# EAGLE design mini-mite (EAGLE 6.2)
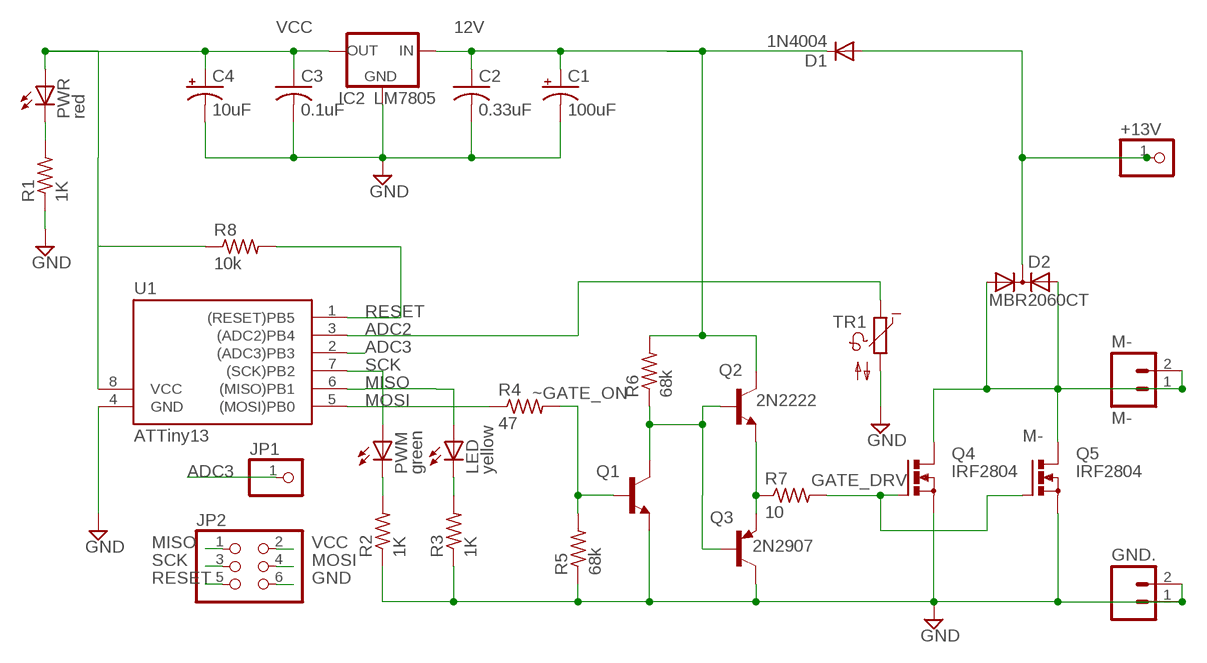
[diagram p0: schematic, sheet 1]

## Parts
+13V  PINHD-1X1  [1X01]
C1  100uF  CPOL-USE2.5-6  [E2,5-6]
C2  0.33uF  C-US025-025X050  [C025-025X050]
C3  0.1uF  C-US025-025X050  [C025-025X050]
C4  10uF  CPOL-USE2.5-6  [E2,5-6]
D1  1N4004  [DO41-10]
D2  MBR2060CT  DIODE-2AC|CATO220V  [TO220ABS]
GND.  M02LOCK_LONGPADS  [1X02_LOCK_LONGPADS]
IC2  LM7805  78XXS  [78XXS]
JP1  PINHD-1X1  [1X01]
JP2  PINHD-2X3  [2X03]
LED  yellow  LED5MM  [LED5MM]
M-  M-  M02LOCK_LONGPADS  [1X02_LOCK_LONGPADS]
PWM  green  LED5MM  [LED5MM]
PWR  red  LED5MM  [LED5MM]
Q1  2N2222  [TO92-EBC-OVAL]
Q2  2N2222  [TO92-EBC-OVAL]
Q3  2N2907  [TO92-EBC-OVAL]
Q4  IRF2804  PMOSFET_NTO220BV  [TO220BV]
Q5  IRF2804  PMOSFET_NTO220BV  [TO220BV]
R1  1K  R-US_0207/7  [0207/7]
R2  1K  R-US_0207/7  [0207/7]
R3  1K  R-US_0207/7  [0207/7]
R4  47  R-US_0207/10  [0207/10]
R5  68k  R-US_0207/7  [0207/7]
R6  68k  R-US_0207/7  [0207/7]
R7  10  R-US_0207/7  [0207/7]
R8  10k  R-US_0207/7  [0207/7]
TR1  NTC642-6  [P642]
U1  ATTiny13  TINY138P3  [DIL08]

## Nets
12V: C1.+ C2.1 D1.C IC2.IN Q2.C R6.2
+13V: +13V.1 D1.A D2.C
ADC2: TR1.1 U1.3((ADC2)PB4)
ADC3: JP1.1 U1.2((ADC3)PB3)
GATE_DRV: Q4.G Q5.G R7.2
GATEON: Q1.C Q2.B Q3.B R6.1
GND: C1.- C2.2 C3.2 C4.- GND..1 GND..2 IC2.GND JP2.6 Q1.E Q3.C Q4.S Q5.S R1.1 R2.1 R3.1 R5.1 TR1.2 U1.4(GND)
M-: D2.A1 D2.A2 M-.1 M-.2 Q4.D Q5.D
MISO: JP2.1 LED.A U1.6((MISO)PB1)
MOSI: JP2.4 R4.1 U1.5((MOSI)PB0)
N$1: LED.K(C) R3.2
N$4: Q2.E Q3.E R7.1
N$5: PWR.K(C) R1.2
N$19: PWM.K(C) R2.2
RESET: JP2.5 R8.2 U1.1((RESET)PB5)
SCK: JP2.3 PWM.A U1.7((SCK)PB2)
VCC: C3.1 C4.+ IC2.OUT JP2.2 PWR.A R8.1 U1.8(VCC)
~GATE_ON: Q1.B R4.2 R5.2

## Library data of the parts
+13V JP1 = pinhead:PINHD-1X1: PIN HEADER
C1 C4 = resistor:CPOL-US: POLARIZED CAPACITOR, American symbol
C2 C3 = rcl:C-US: CAPACITOR, American symbol
D1 = diode:1N4004: DIODE general purpose rectifier, 1 A
D2 = diode:DIODE-2AC|CA: Dual DIODE Anode-Cathode|Cathode-Anode
GND. M- = SparkFun:M02: Header 2 Standard 2-pin 0.1" header. Use with straight break away headers (SKU : PRT-00116), right angle break away headers (PRT-00553), swiss pins (PRT-00743), machine pins (PRT-00117), and female headers (PRT-00115). Molex polarized connector foot print use with SKU : PRT-08233 with associated crimp pins and housings.
IC2 = v-reg:78XXS: VOLTAGE REGULATOR
JP2 = pinhead:PINHD-2X3: PIN HEADER
LED PWM PWR = led:LED: LED OSRAM: - CHIPLED LG R971, LG N971, LY N971, LG Q971, LY Q971, LO R971, LY R971 LH N974, LH R974 LS Q976, LO Q976, LY Q976 LO Q996 - Hyper CHIPLED LW Q18S LB Q993, LB Q99A, LB R99A - SideLED LS A670, LO A670, LY A670, LG A670, LP A670 LB A673, LV A673, LT A673, LW A673 LH A674 LY A675 LS A676, LA A676, LO A676, LY A676, LW A676 LS A679, LY A679, LG A679 - Hyper Micro SIDELED® LS Y876, LA Y876, LO Y876, LY Y876 LT Y87S - SmartLED LW L88C, LW L88S LB L89C, LB L89S, LG L890 LS L89K, LO L89K, LY L89K LS L896, LA L896, LO L896, LY L896 - TOPLED LS T670, LO T670, LY T670, LG T670, LP T670 LSG T670, LSP T670, LSY T670, LOP T670, LYG T670 LG T671, LOG T671, LSG T671 LB T673, LV T673, LT T673, LW T673 LH T674 LS T676, LA T676, LO T676, LY T676, LB T676, LH T676, LSB T676, LW T676 LB T67C, LV T67C, LT T67C, LS T67K, LO T67K, LY T67K, LW E67C LS E67B, LA E67B, LO E67B, LY E67B, LB E67C, LV E67C, LT E67C LW T67C LS T679, LY T679, LG T679 LS T770, LO T770, LY T770, LG T770, LP T770 LB T773, LV T773, LT T773, LW T773 LH T774 LS E675, LA E675, LY E675, LS T675 LS T776, LA T776, LO T776, LY T776, LB T776 LHGB T686 LT T68C, LB T68C - Hyper Mini TOPLED® LB M676 - Mini TOPLED Santana® LG M470 LS M47K, LO M47K, LY M47K Source: http://www.osram.convergy.de LUXEON: - LUMILED® LXK2-PW12-R00, LXK2-PW12-S00, LXK2-PW14-U00, LXK2-PW14-V00 LXK2-PM12-R00, LXK2-PM12-S00, LXK2-PM14-U00 LXK2-PE12-Q00, LXK2-PE12-R00, LXK2-PE12-S00, LXK2-PE14-T00, LXK2-PE14-U00 LXK2-PB12-K00, LXK2-PB12-L00, LXK2-PB12-M00, LXK2-PB14-N00, LXK2-PB14-P00, LXK2-PB14-Q00 LXK2-PR12-L00, LXK2-PR12-M00, LXK2-PR14-Q00, LXK2-PR14-R00 LXK2-PD12-Q00, LXK2-PD12-R00, LXK2-PD12-S00 LXK2-PH12-R00, LXK2-PH12-S00 LXK2-PL12-P00, LXK2-PL12-Q00, LXK2-PL12-R00 Source: www.luxeon.com KINGBRIGHT: KA-3528ASYC Source: www.kingbright.com
Q1 Q2 = adafruit:2N2222: NPN TRANSISTOR Big oval pads
Q3 = adafruit:2N2907*: PNP Transistor Big Oval pads
Q4 Q5 = transistor-power:PMOSFET_N: Power MOSFET N-Channel
R1-R8 = resistor:R-US_: RESISTOR, American symbol
TR1 = ptc-ntc:NTC642-6: PHILIPS NTC
U1 = avr-4:TINY13*

## Net classes
1 power: width 1.27 mm, clearance 0.787 mm

## Board
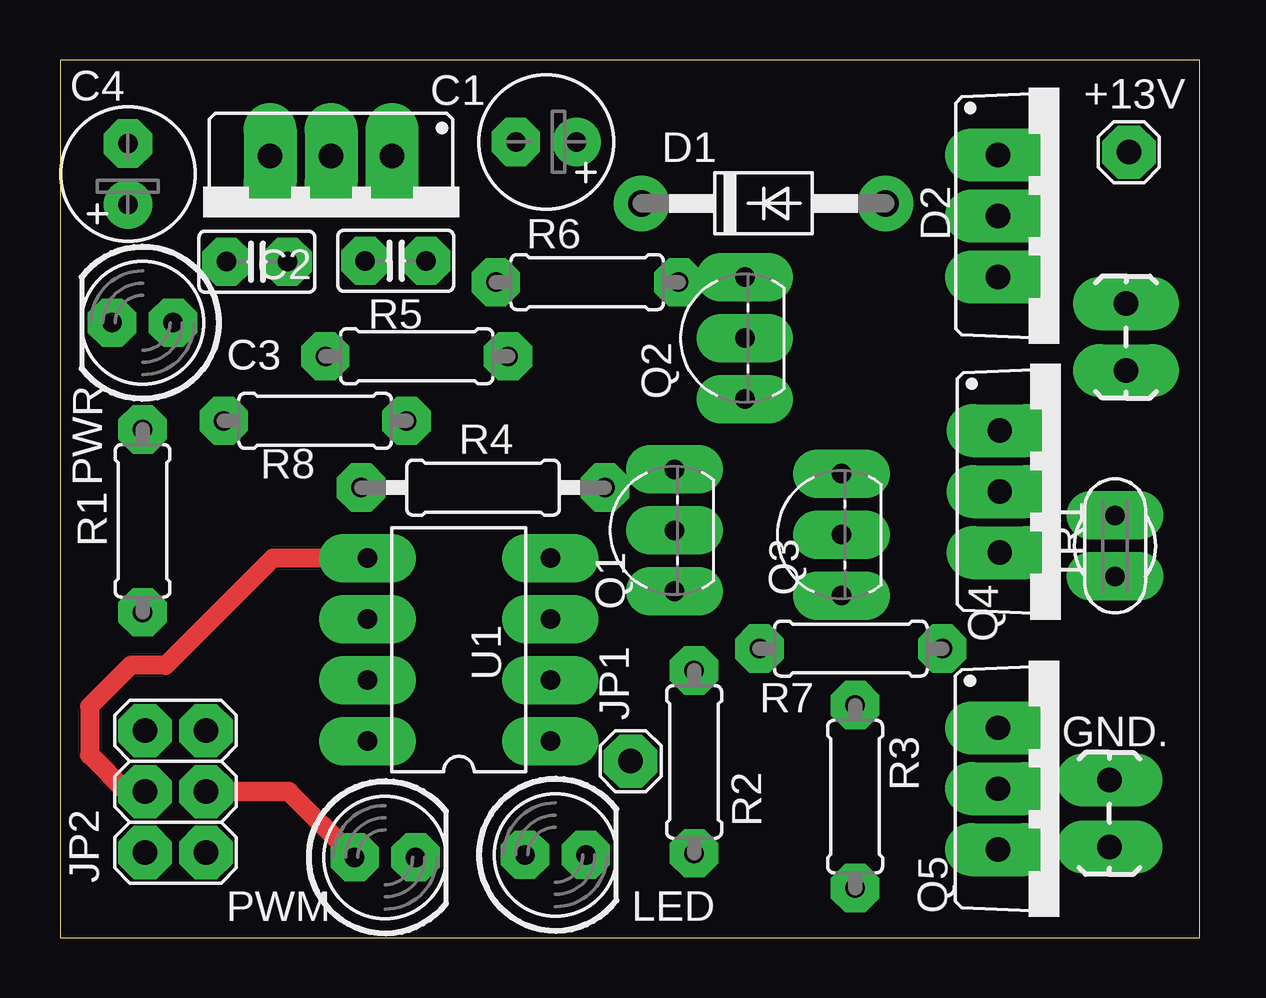
[diagram p1: board, top side]
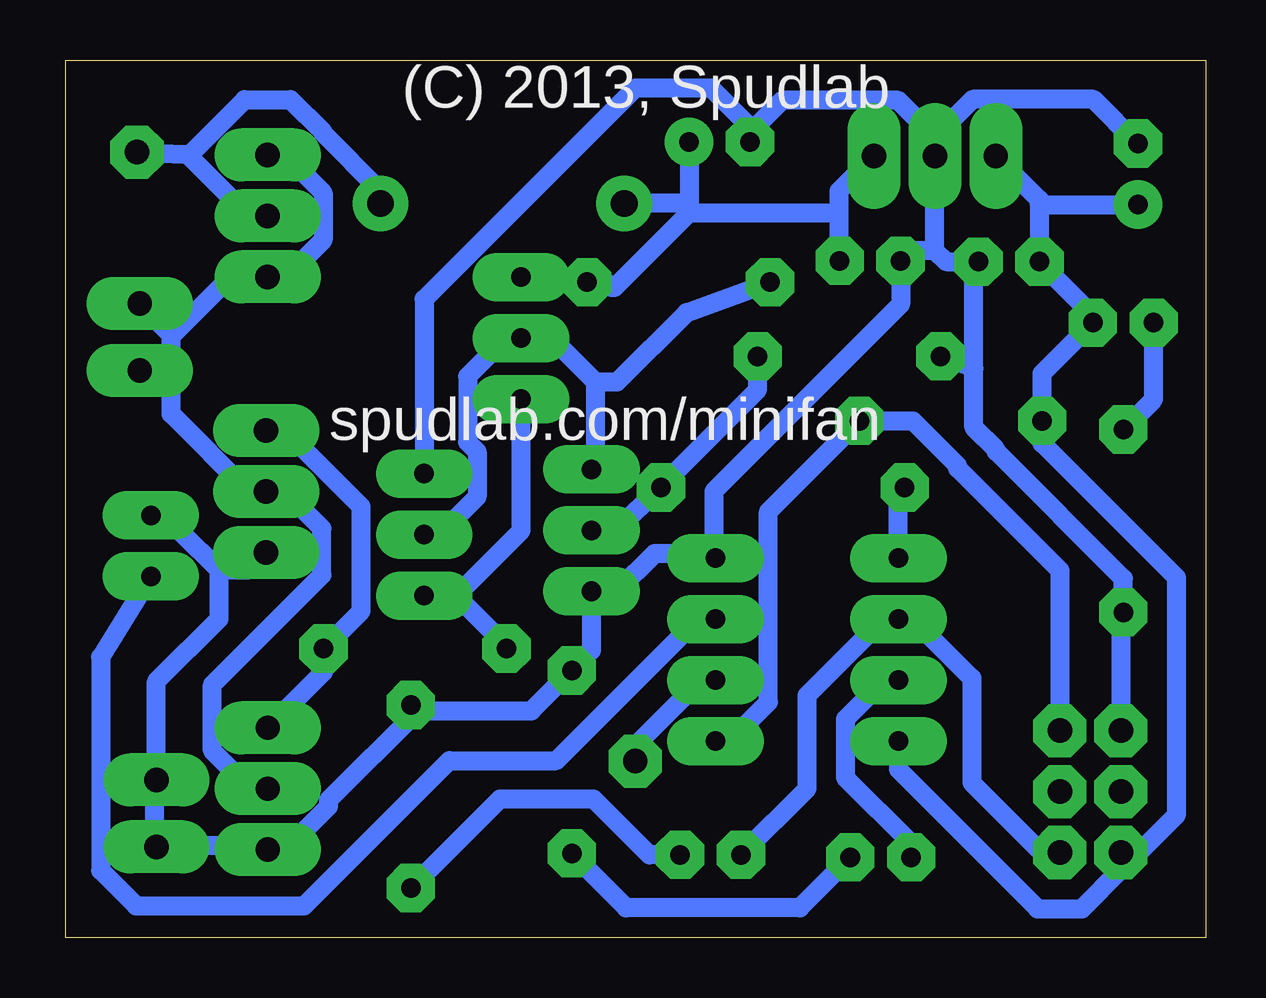
[diagram p2: board, bottom side, seen from below]

Size 47.5 x 36.58 mm. Coordinates in mm from the lower left corner, seen from the top.
Outline: 0,0 47.5,0 47.5,36.58 0,36.58 0,0
Copper layers (1*16): Top 0.035mm / dielectric 1.5mm / Bottom 0.035mm
Design rules: minimum track width 0.8mm, minimum drill 0.8mm, track to track 0.8mm, track to pad 0.8mm, pad to pad 0.3mm, via to via 0.8mm, smd to smd 8mil, copper to edge 10mil, drill to drill 8mil, minimum pad ring 0.6mm, minimum via ring 0.6mm, stop-mask expansion 0mil, vias tented up to drill 0mil, thermal gap 10mil

### Footprints (pad centres in the part's own frame; a part is rotated, then mirrored left to right if it is on the bottom)
1X01 = drill 1.016 octagon: 1 0,0
E2,5-6 = drill 0.813 pad 1.6: + -1.27,0 | drill 0.813 pad 1.6 octagon: - 1.27,0
C025-025X050 = drill 0.813 octagon: 1 -1.27,0; 2 1.27,0
DO41-10 = drill 1.118: A 5.08,0; C -5.08,0
TO220ABS = drill 1.016 long: A1 -2.54,-2.54; A2 2.54,-2.54; C 0,-2.54
1X02_LOCK_LONGPADS = drill 1.016 long: 1 -0.127,0; 2 2.667,0
78XXS = drill 1.016 long: GND 0,-2.54; IN -2.54,-2.54; OUT 2.54,-2.54
2X03 = drill 1.016 octagon: 1 -2.54,-1.27; 2 -2.54,1.27; 3 0,-1.27; 4 0,1.27; 5 2.54,-1.27; 6 2.54,1.27
LED5MM = drill 0.813 octagon: A -1.27,0; K 1.27,0
TO92-EBC-OVAL = drill 0.813 long: B 0,-1.27; C 2.54,-1.27; E -2.54,-1.27
TO220BV = drill 1.016 long: D 0,-2.54; G -2.54,-2.54; S 2.54,-2.54
0207/7 = drill 0.813 octagon: 1 -3.81,0; 2 3.81,0
0207/10 = drill 0.813 octagon: 1 -5.08,0; 2 5.08,0
P642 = drill 0.813 long: 1 -1.27,0; 2 1.27,0
DIL08 = drill 0.813 long: 1 -3.81,-3.81; 2 -1.27,-3.81; 3 1.27,-3.81; 4 3.81,-3.81; 5 3.81,3.81; 6 1.27,3.81; 7 -1.27,3.81; 8 -3.81,3.81

### Placement (x,y rotation side)
+13V  44.54,32.74 180 top
C1  20.26,33.16 180 top
C2  13.99,28.21 180 top
C3  8.2,28.17 0 top
C4  2.83,31.82 90 top
D1  29.31,30.6 0 top
D2  41.63,30.08 270 top
GND.  43.73,6.46 270 top
IC2  11.29,30.03 180 top
JP1  23.77,7.36 90 top
JP2  4.81,6.09 90 top
LED  20.64,3.46 0 top
M-  44.42,26.3 270 top
PWM  13.55,3.35 0 top
PWR  3.44,25.63 180 top
Q1  24.33,16.98 90 top
Q2  27.26,24.98 90 top
Q3  31.3,16.8 90 top
Q4  41.69,18.59 270 top
Q5  41.63,6.21 270 top
R1  3.44,17.37 90 top
R2  26.42,7.33 270 top
R3  33.13,5.89 270 top
R4  17.63,18.76 0 top
R5  14.86,24.23 0 top
R6  21.97,27.32 0 top
R7  32.95,12.05 0 top
R8  10.63,21.54 0 top
TR1  43.96,16.33 90 top
U1  16.62,12.01 90 top

### Tracks (layer width: path | path; a pad name or v marks a point on that pad's centre or on a via)
12V
  Bottom 0.8: 24.76,27.1 25.19,27.52 Q2.C | 24.76,27.1 R6.2 | 21.53,30.2 24.63,27.1 24.76,27.1 | 21.53,30.6 D1.C | 21.53,30.6 21.53,30.2 | C1.+ 21.53,30.6 | 15.29,30.2 15.29,28.24 C2.1 | IC2.IN 15.29,31.12 15.29,30.2 | 21.53,30.2 15.29,30.2
+13V
  Bottom 0.8: 42.38,32.59 39.87,30.08 D2.C | +13V.1 42.54,32.64 42.44,32.64 42.38,32.59 | 42.38,32.59 40.05,34.93 38.13,34.93 36.78,33.58 36.78,33.52 34.39,31.13 D1.A
ADC2
  Bottom 0.8: TR1.1 46.06,11.7 46.06,2.81 44.58,1.33 37.57,1.33 31.52,7.38 27.06,7.38 21.16,13.28 U1.3
ADC3
  Bottom 0.8: U1.2 21.04,10.74 23.77,8 JP1.1
GATE_DRV
  Bottom 0.8: Q5.G 36.76,11.08 R7.2 35.2,13.61 35.2,17.97 38.37,21.13 Q4.G
GATEON
  Bottom 0.8: 28.53,24.65 29.5,24.65 30.76,23.39 30.76,20.65 30.36,20.26 30.36,18.38 31.93,16.8 Q3.B | 28.53,24.65 26.93,24.65 25.44,23.16 | 28.53,24.65 Q2.B | 25.44,23.16 24.53,23.16 21.64,26.05 R6.1 | 25.44,23.16 25.44,19.68 Q1.C
GND
  Bottom 0.8: 18.87,33.67 20.61,35.41 23.77,35.41 32.57,26.61 Q3.C | 9.66,23.72 9.66,28.17 | 9.66,23.72 9.66,21.26 8.74,20.34 8.74,20.27 3.44,14.96 R1.1 3.54,13.46 JP2.6 | 9.66,23.72 R5.1 | 20.62,16.01 22.96,16.01 24.54,14.44 Q1.E 25.6,11.96 R2.1 28.11,9.46 32.83,9.46 32.86,9.43 | 39.09,3.83 43.77,3.83 43.81,3.87 | 32.86,9.43 36.56,5.72 36.56,5.46 38.12,3.9 38.38,3.9 38.46,3.83 39.09,3.83 | 39.09,3.83 Q5.S | 41.12,15.34 39.87,15.34 Q4.S | 32.86,9.43 R3.1 | 41.12,15.34 41.12,13.29 43.73,10.69 GND..1 43.81,6.5 43.81,3.87 | 43.81,3.87 GND..2 | TR1.2 42.74,16.97 41.12,15.34 | 20.62,16.01 20.5,16.14 20.5,18.61 12.72,26.39 C2.2 12.29,28.64 11.29,28.64 | 18.87,33.67 18.87,33.28 C1.- | 11.29,33.37 12.82,34.89 17.66,34.89 18.87,33.67 | U1.4 20.62,16.01 | 9.66,28.17 C3.2 | 11.29,28.64 10.83,28.17 9.66,28.17 | 11.29,28.64 IC2.GND 11.29,33.37 | C4.- 4.67,34.94 9.72,34.94 11.29,33.37
M-
  Bottom 0.8: D2.A1 38.37,32.62 36.78,31.04 36.78,29.07 38.31,27.54 D2.A2 39.14,27.49 40.7,27.49 43.09,25.1 | Q5.D 39.81,6.21 41.4,7.8 41.4,10.55 36.83,15.11 36.83,17.06 38.37,18.59 Q4.D 39.88,18.59 43.12,21.83 43.12,23 | 43.12,23 43.12,25.07 43.09,25.1 | 43.09,25.1 M-.1 | 43.12,23 M-.2
MISO
  Bottom 0.8: LED.A 16.62,6.21 16.62,10.1 13.44,13.28 U1.6 12.21,13.28 9.75,10.82 9.75,6.47 6.83,3.55 JP2.1
MOSI
  Top 0.8: U1.5 8.87,15.82 4.4,11.36 2.94,11.36 1.23,9.65 1.23,7.62 2.77,6.09 JP2.4
  Bottom 0.8: U1.5 12.81,18.5 R4.1
N$1
  Bottom 0.8: LED.K 23.18,3.46 25.51,5.78 29.42,5.78 R3.2
N$4
  Bottom 0.8: 31.24,14.26 Q3.E | 31.24,14.26 28.53,16.97 Q2.E | 31.24,14.26 29.14,12.17 R7.1
N$5
  Bottom 0.8: R1.2 2.17,22.45 PWR.K
N$19
  Bottom 0.8: PWM.K 16.92,1.25 24.15,1.25 R2.2
RESET
  Bottom 0.8: JP2.5 6.08,15.31 10.34,19.57 10.34,19.67 12.21,21.54 R8.2 18.22,17.76 18.22,9.82 19.85,8.2 U1.1
SCK
  Top 0.8: PWM.A 9.54,6.09 JP2.3
  Bottom 0.8: U1.7 13.39,10.74 15.02,9.11 15.02,6.67 12.28,3.93 PWM.A
VCC
  Bottom 0.8: 6.93,30.55 C3.1 4.71,25.95 PWR.A 6.82,23.52 R8.1 6.82,20.61 1.22,15.01 1.22,5.13 2.8,3.55 JP2.2 3.54,2.83 5.16,1.21 7,1.21 12.81,7.01 U1.8 | 6.93,30.55 C4.+ | 6.93,30.55 6.93,30.76 IC2.OUT
~GATE_ON
  Bottom 0.8: 22.73,18.78 18.67,22.84 R5.2 | 22.73,18.78 24.54,16.98 Q1.B | 22.73,18.78 R4.2

### Text on the board
bNames: (C) 2013, Spudlab | spudlab.com/minifan